# Altium schematic sheet 09.Ethernet-RGMII.SchDoc
size A3; CheckDate: CheckedDate; CheckedBy: YPC; DocumentNumber: 9; Revision: V1.00; SheetNumber: 09; SheetTotal: 18; SheetName: Ethernet-RGMII; SheetDescribe: 千兆以太网; Designer: JOW; DesignDate: 2025-04-25; CheckedData: 2025-04-25; Rule: PcbType=ProtelPcb
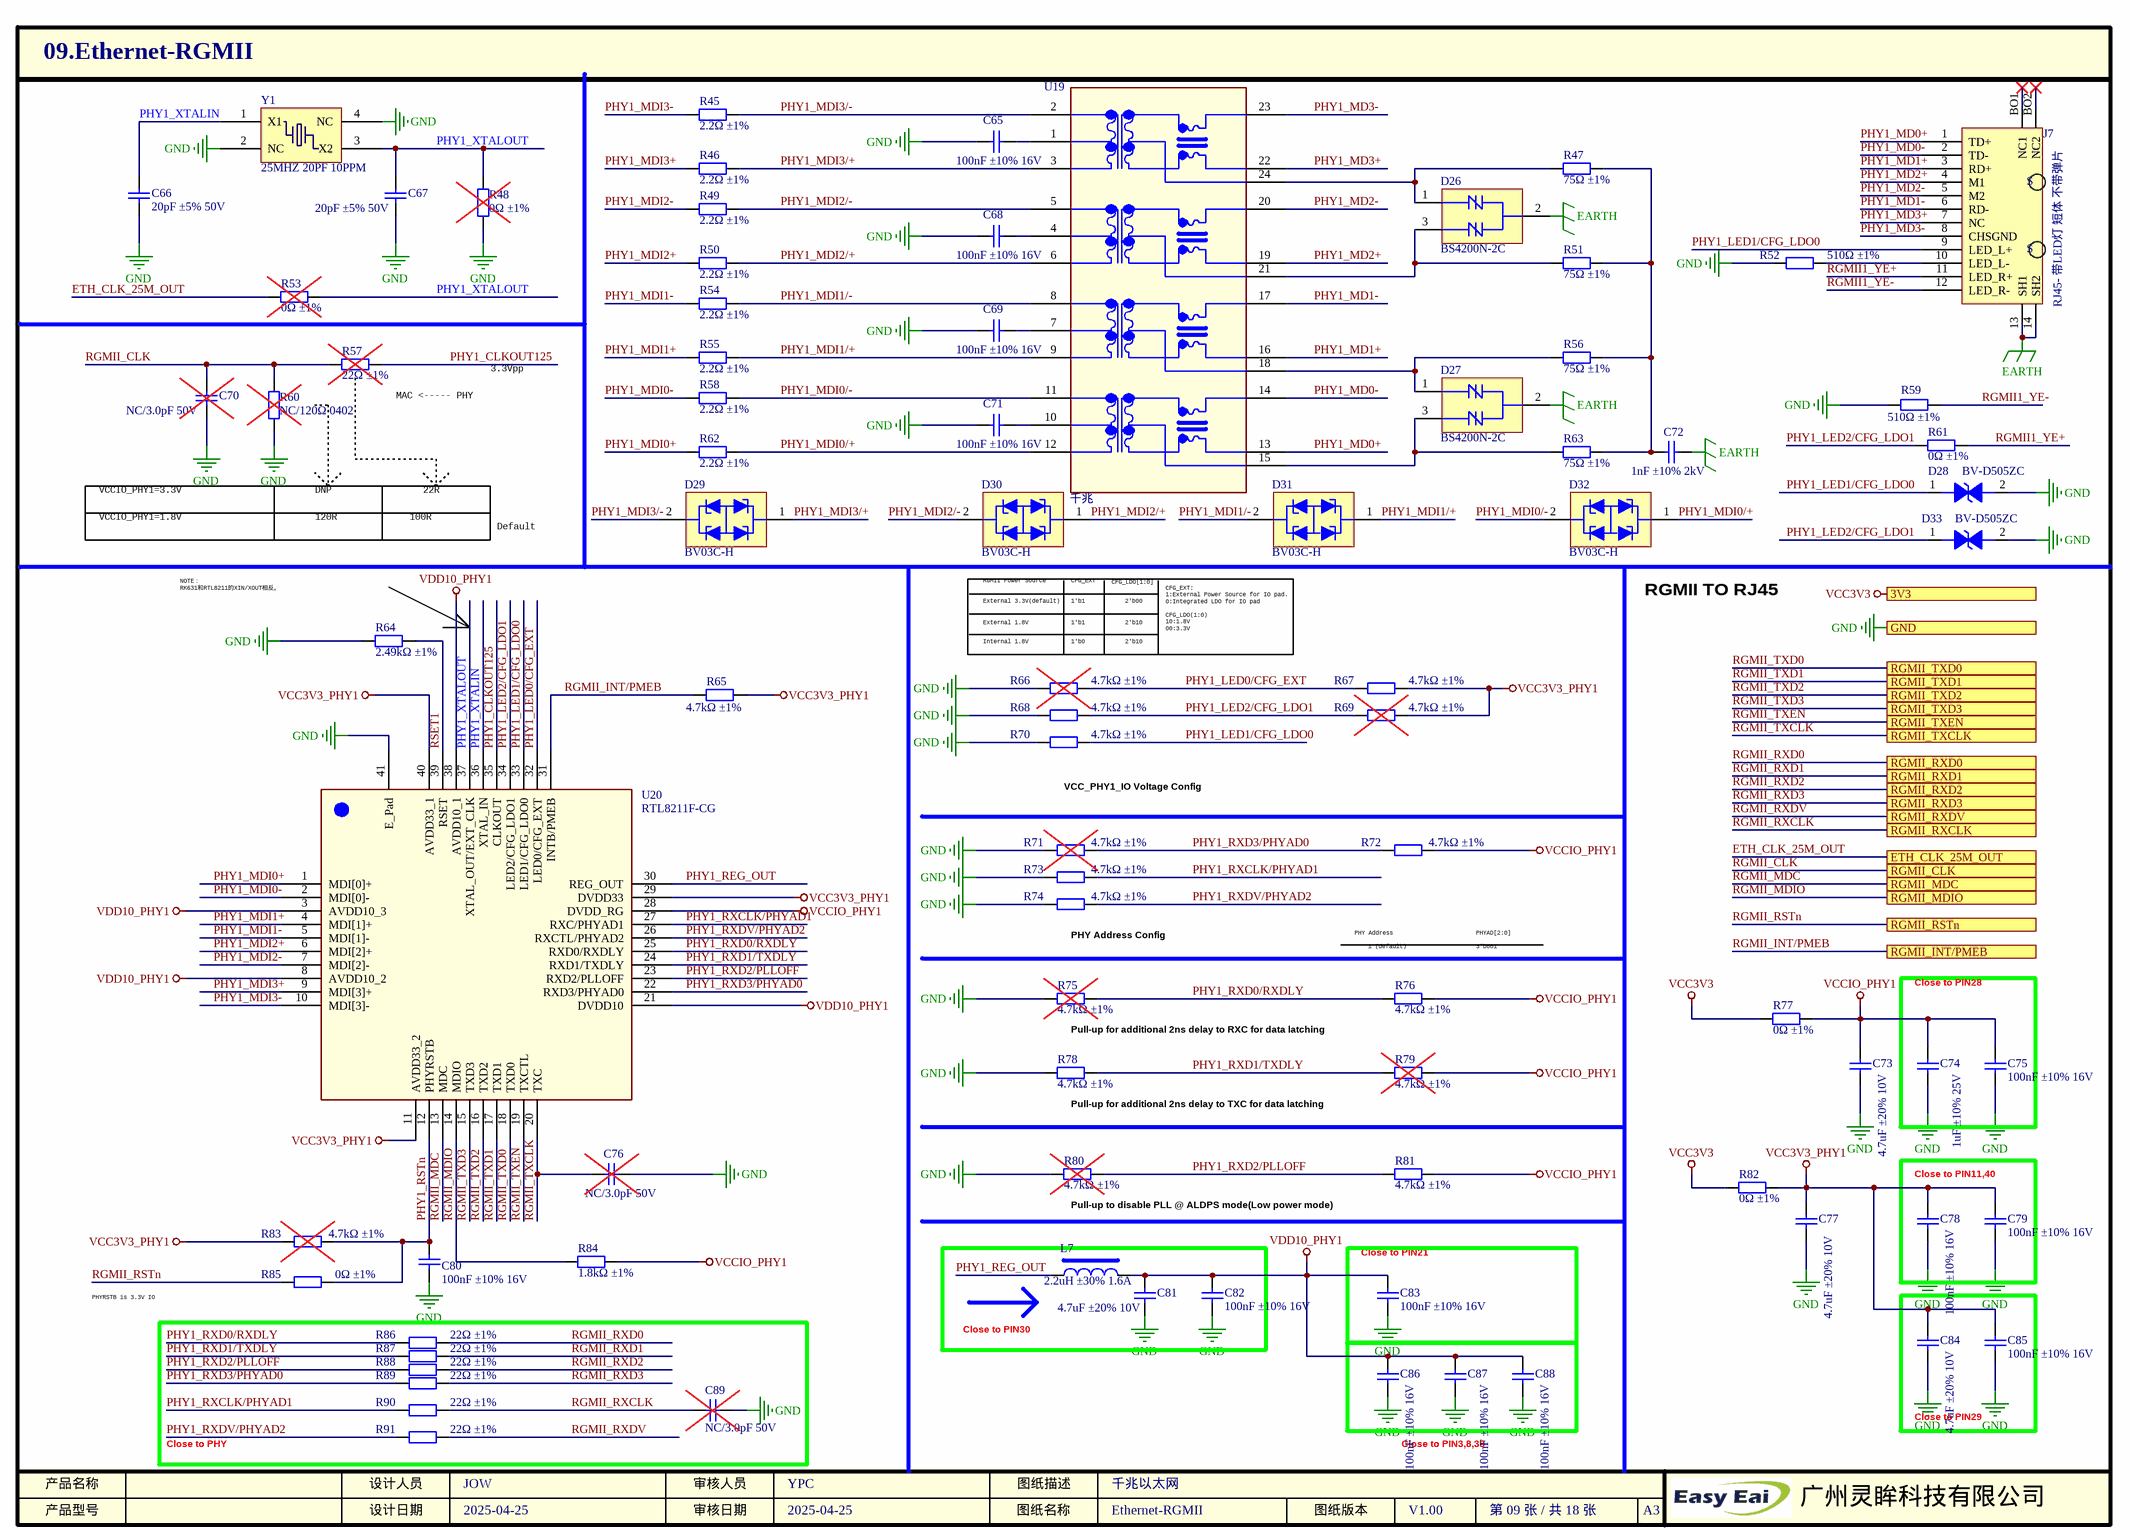
[diagram p0: 09.Ethernet-RGMII.SchDoc]

## Parts
C65  描述: 100nF ±10% 16V  [0402_C]  (hidden comment: CL05B104KO5NNNC)
C66  描述: 20pF ±5% 50V  [0402_C]  (hidden comment: 0402CG200J500NT)
C67  描述: 20pF ±5% 50V  [0402_C]  (hidden comment: 0402CG200J500NT)
C68  描述: 100nF ±10% 16V  [0402_C]  (hidden comment: CL05B104KO5NNNC)
C69  描述: 100nF ±10% 16V  [0402_C]  (hidden comment: CL05B104KO5NNNC)
C70  NC/3.0pF 50V  [0402_C]  (no BOM)
C71  描述: 100nF ±10% 16V  [0402_C]  (hidden comment: CL05B104KO5NNNC)
C72  描述: 1nF ±10% 2kV  [1206_C]  (hidden comment: CC1206KKX7RDBB102)
C73  描述: 4.7uF ±20% 10V  [0402_C]  (hidden comment: CL05A475MP5NRNC)
C74  描述: 1uF ±10% 25V  [0402_C]  (hidden comment: CL05A105KA5NQNC)
C75  描述: 100nF ±10% 16V  [0402_C]  (hidden comment: CL05B104KO5NNNC)
C76  NC/3.0pF 50V  [0402_C]  (no BOM)
C77  描述: 4.7uF ±20% 10V  [0402_C]  (hidden comment: CL05A475MP5NRNC)
C78  描述: 100nF ±10% 16V  [0402_C]  (hidden comment: CL05B104KO5NNNC)
C79  描述: 100nF ±10% 16V  [0402_C]  (hidden comment: CL05B104KO5NNNC)
C80  描述: 100nF ±10% 16V  [0402_C]  (hidden comment: CL05B104KO5NNNC)
C81  描述: 4.7uF ±20% 10V  [0402_C]  (hidden comment: CL05A475MP5NRNC)
C82  描述: 100nF ±10% 16V  [0402_C]  (hidden comment: CL05B104KO5NNNC)
C83  描述: 100nF ±10% 16V  [0402_C]  (hidden comment: CL05B104KO5NNNC)
C84  描述: 4.7uF ±20% 10V  [0402_C]  (hidden comment: CL05A475MP5NRNC)
C85  描述: 100nF ±10% 16V  [0402_C]  (hidden comment: CL05B104KO5NNNC)
C86  描述: 100nF ±10% 16V  [0402_C]  (hidden comment: CL05B104KO5NNNC)
C87  描述: 100nF ±10% 16V  [0402_C]  (hidden comment: CL05B104KO5NNNC)
C88  描述: 100nF ±10% 16V  [0402_C]  (hidden comment: CL05B104KO5NNNC)
C89  NC/3.0pF 50V  [0402_C]  (no BOM)
D26  BS4200N-2C  [SMB-T_L5.4-W3.3-BI]
D27  BS4200N-2C  [SMB-T_L5.4-W3.3-BI]
D28  BV-D505ZC  [SOD-523]
D29  BV03C-H  [SOD-323]
D30  BV03C-H  [SOD-323]
D31  BV03C-H  [SOD-323]
D32  BV03C-H  [SOD-323]
D33  BV-D505ZC  [SOD-523]
J7  R-RJ45R08P-C000  [RJ45/LED-1575X1626X1310]  (value not drawn)
L7  SWPA3015S2R2NT  [IND-SMD_L3.0-W3.0]  (value not drawn)
R45  描述: 2.2Ω ±1%  [0402_R]  (hidden comment: 0402WGF220KTCE)
R46  描述: 2.2Ω ±1%  [0402_R]  (hidden comment: 0402WGF220KTCE)
R47  描述: 75Ω ±1%  [0805_R]  (hidden comment: RS-05K75R0FT)
R48  描述: 0Ω ±1%  [0402_R]  (hidden comment: NC/0402WGF0000TCE)  (no BOM)
R49  描述: 2.2Ω ±1%  [0402_R]  (hidden comment: 0402WGF220KTCE)
R50  描述: 2.2Ω ±1%  [0402_R]  (hidden comment: 0402WGF220KTCE)
R51  描述: 75Ω ±1%  [0805_R]  (hidden comment: RS-05K75R0FT)
R52  描述: 510Ω ±1%  [0402_R]  (hidden comment: 0402WGF5100TCE)
R53  描述: 0Ω ±1%  [0402_R]  (hidden comment: NC/0402WGF0000TCE)  (no BOM)
R54  描述: 2.2Ω ±1%  [0402_R]  (hidden comment: 0402WGF220KTCE)
R55  描述: 2.2Ω ±1%  [0402_R]  (hidden comment: 0402WGF220KTCE)
R56  描述: 75Ω ±1%  [0805_R]  (hidden comment: RS-05K75R0FT)
R57  描述: 22Ω ±1%  [0402_R]  (hidden comment: 0402WGF220JTCE)  (no BOM)
R58  描述: 2.2Ω ±1%  [0402_R]  (hidden comment: 0402WGF220KTCE)
R59  描述: 510Ω ±1%  [0402_R]  (hidden comment: 0402WGF5100TCE)
R60  NC/120Ω 0402  [0402_R]  (no BOM)
R61  描述: 0Ω ±1%  [0402_R]  (hidden comment: 0402WGF0000TCE)
R62  描述: 2.2Ω ±1%  [0402_R]  (hidden comment: 0402WGF220KTCE)
R63  描述: 75Ω ±1%  [0805_R]  (hidden comment: RS-05K75R0FT)
R64  描述: 2.49kΩ ±1%  [0402_R]  (hidden comment: AC0402FR-072K49L)
R65  描述: 4.7kΩ ±1%  [0402_R]  (hidden comment: 0402WGF4701TCE)
R66  描述: 4.7kΩ ±1%  [0402_R]  (hidden comment: NC/0402WGF4701TCE)  (no BOM)
R67  描述: 4.7kΩ ±1%  [0402_R]  (hidden comment: 0402WGF4701TCE)
R68  描述: 4.7kΩ ±1%  [0402_R]  (hidden comment: 0402WGF4701TCE)
R69  描述: 4.7kΩ ±1%  [0402_R]  (hidden comment: NC/0402WGF4701TCE)  (no BOM)
R70  描述: 4.7kΩ ±1%  [0402_R]  (hidden comment: 0402WGF4701TCE)
R71  描述: 4.7kΩ ±1%  [0402_R]  (hidden comment: NC/0402WGF4701TCE)  (no BOM)
R72  描述: 4.7kΩ ±1%  [0402_R]  (hidden comment: 0402WGF4701TCE)
R73  描述: 4.7kΩ ±1%  [0402_R]  (hidden comment: 0402WGF4701TCE)
R74  描述: 4.7kΩ ±1%  [0402_R]  (hidden comment: 0402WGF4701TCE)
R75  描述: 4.7kΩ ±1%  [0402_R]  (hidden comment: NC/0402WGF4701TCE)  (no BOM)
R76  描述: 4.7kΩ ±1%  [0402_R]  (hidden comment: 0402WGF4701TCE)
R77  描述: 0Ω ±1%  [0402_R]  (hidden comment: 0402WGF0000TCE)
R78  描述: 4.7kΩ ±1%  [0402_R]  (hidden comment: 0402WGF4701TCE)
R79  描述: 4.7kΩ ±1%  [0402_R]  (hidden comment: NC/0402WGF4701TCE)  (no BOM)
R80  描述: 4.7kΩ ±1%  [0402_R]  (hidden comment: NC/0402WGF4701TCE)  (no BOM)
R81  描述: 4.7kΩ ±1%  [0402_R]  (hidden comment: 0402WGF4701TCE)
R82  描述: 0Ω ±1%  [0402_R]  (hidden comment: 0402WGF0000TCE)
R83  描述: 4.7kΩ ±1%  [0402_R]  (hidden comment: NC/0402WGF4701TCE)  (no BOM)
R84  描述: 1.8kΩ ±1%  [0402_R]  (hidden comment: 0402WGF1801TCE)
R85  描述: 0Ω ±1%  [0402_R]  (hidden comment: 0402WGF0000TCE)
R86  描述: 22Ω ±1%  [0402_R]  (hidden comment: 0402WGF220JTCE)
R87  描述: 22Ω ±1%  [0402_R]  (hidden comment: 0402WGF220JTCE)
R88  描述: 22Ω ±1%  [0402_R]  (hidden comment: 0402WGF220JTCE)
R89  描述: 22Ω ±1%  [0402_R]  (hidden comment: 0402WGF220JTCE)
R90  描述: 22Ω ±1%  [0402_R]  (hidden comment: 0402WGF220JTCE)
R91  描述: 22Ω ±1%  [0402_R]  (hidden comment: 0402WGF220JTCE)
U19  描述: 千兆  [SMD-24_L15.1-W7.1-P1.00-LS10.0-BL]  (hidden comment: G2401CE)
U20  RTL8211F-CG  [QFN40P500X500X90_HS-41N]
Y1  X322525MSB4SI  [SMD-3225_4P]  (value not drawn)

## Blocks framed on the sheet
Close to PIN28: C74 C75
Close to PIN11,40: C78 C79
Close to PIN30: C81 C82 L7
Close to PIN21: C83
Close to PHY: C89 R86-R91
Close to PIN29: C84 C85

## Ports
3V3, ETH_CLK_25M_OUT, GND, RGMII_CLK, RGMII_INT/PMEB, RGMII_MDC, RGMII_MDIO, RGMII_RSTn, RGMII_RXCLK, RGMII_RXD0, RGMII_RXD1, RGMII_RXD2, RGMII_RXD3, RGMII_RXDV, RGMII_TXCLK, RGMII_TXD0, RGMII_TXD1, RGMII_TXD2, RGMII_TXD3, RGMII_TXEN

## Nets
EARTH: C72.2 D26.2 D27.2 J7.13(SH1) J7.14(SH2)
GND: C65.1 C66.1 C67.1 C68.1 C69.1 C70.1 C71.1 C73.1 C74.1 C75.1 C76.2 C77.1 C78.1 C79.1 C80.1 C81.1 C82.1 C83.1 C84.1 C85.1 C86.1 C87.1 C88.1 C89.1 D28.2 D33.2 R48.1 R52.1 R59.1 R60.1 R64.1 R66.1 R68.1 R70.1 R71.1 R73.1 R74.1 R75.1 R78.1 R80.1 U20.41(E_Pad) Y1.2(NC) Y1.4(NC) ; port GND
VCC3V3: R77.1 R82.1 ; port 3V3
VCC3V3_PHY1: C77.2 C78.2 C79.2 C84.2 C85.2 R65.2 R67.2 R69.2 R82.2 R83.1 U20.11(AVDD33_2) U20.29(DVDD33) U20.40(AVDD33_1)
VCCIO_PHY1: C73.2 C74.2 C75.2 R72.2 R76.2 R77.2 R79.2 R81.2 R84.2 U20.28(DVDD_RG)
VDD10_PHY1: C81.2 C82.2 C83.2 C86.2 C87.2 C88.2 L7.2 U20.3(AVDD10_3) U20.8(AVDD10_2) U20.21(DVDD10) U20.38(AVDD10_1)
ETH_CLK_25M_OUT: R53.2 ; port ETH_CLK_25M_OUT
PHY1_CLKOUT125: R57.2 U20.35(CLKOUT)
PHY1_LED0/CFG_EXT: R66.2 R67.1 U20.32(LED0/CFG_EXT)
PHY1_LED1/CFG_LDO0: D28.1 J7.9(LED_L+) R70.2 U20.33(LED1/CFG_LDO0)
PHY1_LED2/CFG_LDO1: D33.1 R61.1 R68.2 R69.1 U20.34(LED2/CFG_LDO1)
PHY1_MD0+: J7.1(TD+) U19.13
PHY1_MD0-: J7.2(TD-) U19.14
PHY1_MD1+: J7.3(RD+) U19.16
PHY1_MD1-: J7.6(RD-) U19.17
PHY1_MD2+: J7.4(M1) U19.19
PHY1_MD2-: J7.5(M2) U19.20
PHY1_MD3+: J7.7(NC) U19.22
PHY1_MD3-: J7.8(CHSGND) U19.23
PHY1_MDI0+: R62.1 U20.1(MDI[0]+)
PHY1_MDI0-: R58.1 U20.2(MDI[0]-)
PHY1_MDI0/+: D32.1 R62.2 U19.12
PHY1_MDI0/-: D32.2 R58.2 U19.11
PHY1_MDI1+: R55.1 U20.4(MDI[1]+)
PHY1_MDI1-: R54.1 U20.5(MDI[1]-)
PHY1_MDI1/+: D31.1 R55.2 U19.9
PHY1_MDI1/-: D31.2 R54.2 U19.8
PHY1_MDI2+: R50.1 U20.6(MDI[2]+)
PHY1_MDI2-: R49.1 U20.7(MDI[2]-)
PHY1_MDI2/+: D30.1 R50.2 U19.6
PHY1_MDI2/-: D30.2 R49.2 U19.5
PHY1_MDI3+: R46.1 U20.9(MDI[3]+)
PHY1_MDI3-: R45.1 U20.10(MDI[3]-)
PHY1_MDI3/+: D29.1 R46.2 U19.3
PHY1_MDI3/-: D29.2 R45.2 U19.2
PHY1_REG_OUT: L7.1 U20.30(REG_OUT)
PHY1_RSTn: C80.2 R83.2 R85.2 U20.12(PHYRSTB)
PHY1_RXCLK/PHYAD1: R73.2 R90.1 U20.27(RXC/PHYAD1)
PHY1_RXD0/RXDLY: R75.2 R76.1 R86.1 U20.25(RXD0/RXDLY)
PHY1_RXD1/TXDLY: R78.2 R79.1 R87.1 U20.24(RXD1/TXDLY)
PHY1_RXD2/PLLOFF: R80.2 R81.1 R88.1 U20.23(RXD2/PLLOFF)
PHY1_RXD3/PHYAD0: R71.2 R72.1 R89.1 U20.22(RXD3/PHYAD0)
PHY1_RXDV/PHYAD2: R74.2 R91.1 U20.26(RXCTL/PHYAD2)
PHY1_XTALIN: C66.2 U20.36(XTAL_IN) Y1.1(X1)
PHY1_XTALOUT: C67.2 R48.2 R53.1 U20.37(XTAL_OUT/EXT_CLK) Y1.3(X2)
RGMII1_YE+: J7.11(LED_R+) R61.2
RGMII1_YE-: J7.12(LED_R-) R59.2
RGMII_CLK: C70.2 R57.1 R60.2 ; port RGMII_CLK
RGMII_INT/PMEB: R65.1 U20.31(INTB/PMEB) ; port RGMII_INT/PMEB
RGMII_MDC: U20.13(MDC) ; port RGMII_MDC
RGMII_MDIO: R84.1 U20.14(MDIO) ; port RGMII_MDIO
RGMII_RSTn: R85.1 ; port RGMII_RSTn
RGMII_RXCLK: C89.2 R90.2 ; port RGMII_RXCLK
RGMII_RXD0: R86.2 ; port RGMII_RXD0
RGMII_RXD1: R87.2 ; port RGMII_RXD1
RGMII_RXD2: R88.2 ; port RGMII_RXD2
RGMII_RXD3: R89.2 ; port RGMII_RXD3
RGMII_RXDV: R91.2 ; port RGMII_RXDV
RGMII_TXCLK: C76.1 U20.20(TXC) ; port RGMII_TXCLK
RGMII_TXD0: U20.18(TXD0) ; port RGMII_TXD0
RGMII_TXD1: U20.17(TXD1) ; port RGMII_TXD1
RGMII_TXD2: U20.16(TXD2) ; port RGMII_TXD2
RGMII_TXD3: U20.15(TXD3) ; port RGMII_TXD3
RGMII_TXEN: U20.19(TXCTL) ; port RGMII_TXEN
RSET1: R64.2 U20.39(RSET)
NetC65_2: C65.2 U19.1
NetC68_2: C68.2 U19.4
NetC69_2: C69.2 U19.7
NetC71_2: C71.2 U19.10
NetC72_1: C72.1 R47.2 R51.2 R56.2 R63.2
NetD26_1: D26.1 R47.1 U19.24
NetD26_3: D26.3 R51.1 U19.21
NetD27_1: D27.1 R56.1 U19.18
NetD27_3: D27.3 R63.1 U19.15
NetJ7_10: J7.10(LED_L-) R52.2

Not connected (* = marked no-connect by the designer): J7 BO1(NC1)* BO2(NC2)*

## Notes on the sheet
- (near R57) MAC <----- PHY
- 3.3Vpp
- VCCIO_PHY1=3.3V
- VCCIO_PHY1=1.8V
- DNP
- 120R
- 100R
- 22R
- Default
- (near R64) NOTE：
  RK631和RTL8211的XIN/XOUT相反。
- RGMII Power Source
- External 3.3V(default)
- CFG_EXT
- 1'b1
- CFG_LDO[1:0]
- 2'b00
- RGMII TO RJ45
- External 1.8V
- Internal 1.8V
- (near R66) 1'b0
- 2'b10
- CFG_EXT:
  1:External Power Source for IO pad.
  0:Integrated LDO for IO pad
  CFG_LDO(1:0)
  10:1.8V
  00:3.3V
- VCC_PHY1_IO Voltage Config
- (near R74) PHY Address Config
- PHY Address
- PHYAD[2:0]
- (near R76) 1 (default)
- 3'b001
- Pull-up for additional 2ns delay to RXC for data latching
- (near R78) Pull-up for additional 2ns delay to TXC for data latching
- (near R80) Pull-up to disable PLL @ ALDPS mode(Low power mode)
- PHYRSTB is 3.3V IO
- Close to PIN3,8,38
- 产品名称
- 产品型号
- 设计人员
- 设计日期
- 审核人员
- 审核日期
- 图纸名称
- 图纸描述
- 图纸版本
- A3
- 广州灵眸科技有限公司
- (in symbol RJ45- 带LED灯 短体 不带弹片) S

## Library data of the parts
C65 C68 C69 C71 C75 C78-C80 C82 C83 C85-C88 = 0402 100nF ±10% 16V: SPZL000259; 名称: 贴片电容; 厂商: SAMSUNG(三星); 封装: 0402; 工作温度: -55~125℃; 贴片和直插: SMD; 型号: CL05B104KO5NNNC; SuppliersPartNumber: C1525; 商品编号: SPZL000259
C66 C67 = 0402 20pF ±5% 50V: SPZL000398; 名称: 贴片电容; 厂商: FH(风华); 封装: 0402; 工作温度: -55~125℃; 贴片和直插: SMD; 型号: 0402CG200J500NT; SuppliersPartNumber: C1554; 商品编号: SPZL000398
C70 C76 C89 = 0402 2.0pF (2R0) 0.25pF 50V: 贴片电容; ComponentLink1Description: 供应商链接; ComponentLink1URL: http://www.szlcsc.com/product/details_1910.html; Package: 0402; Supplier: LC
C72 = 1206 1nF ±10% 2kV: SPZL000332; 名称: 贴片电容; 厂商: YAGEO(国巨); 封装: 1206; 工作温度: -55~125℃; 贴片和直插: SMD; 型号: CC1206KKX7RDBB102; SuppliersPartNumber: C23631; 商品编号: SPZL000332
C73 C77 C81 C84 = 0402 4.7uF ±20% 10V: SPZL000339; 名称: 贴片电容; 厂商: SAMSUNG(三星); 封装: 0402; 工作温度: -55~85℃; 贴片和直插: SMD; 型号: CL05A475MP5NRNC; SuppliersPartNumber: C23733; 商品编号: SPZL000339
C74 = 0402 1uF ±10% 25V: SPZL000337; 名称: 贴片电容; 厂商: SAMSUNG(三星); 封装: 0402; 工作温度: -55~85℃; 贴片和直插: SMD; 型号: CL05A105KA5NQNC; SuppliersPartNumber: C52923; 商品编号: SPZL000337
D26 D27 = 放电管 BS4200N-2C: SPZL000612; 名称: 放电管; 封装: SMB-T; 贴片和直插: SMD; 厂商: Bencent(槟城); 工作温度: -40~125℃; 商品编号: SPZL000612; 型号: BS4200N-2C
D28 D33 = ESD BV-D505ZC: SPZL000613; 名称: ESD; 贴片和直插: SMD; 厂商: Bencent(槟城); 描述: Vdrm=5V Cj=15pF; 工作温度: -40~125℃; SuppliersPartNumber: C459520; 封装: SOD-523; 商品编号: SPZL000613; 型号: BV-D505ZC
D29-D32 = ESD BV03C-H: SPZL000614; 名称: ESD; 贴片和直插: SMD; 厂商: Bencent(槟城); 描述: Vdrm=3.3V Cj=1.5pF; 工作温度: -55~150℃; 封装: SOD-323; SuppliersPartNumber: C883203; 商品编号: SPZL000614; 型号: BV03C-H
J7 = RJ45- 带LED灯 短体 不带弹片: SPZL000140; 名称: RJ45插座; 贴片和直插: THT; 封装: Through Hole; 厂商: Ckmtw(灿科盟); 工作温度: 0~70℃; SuppliersPartNumber: C386757; 型号: R-RJ45R08P-C000; 商品编号: SPZL000140; 描述: RJ45- 带LED灯 短体 不带弹片
L7 = 2.2uH ±30% 1.6A: SPZL000721; 名称: 电感; 厂商: Sunlord(顺络); 封装: SMD; 工作温度: -40~125℃; 型号: SWPA3015S2R2NT; SuppliersPartNumber: C19734; 贴片和直插: SMD; 商品编号: SPZL000721; 描述: 2.2uH ±30% 1.6A
R45 R46 R49 R50 R54 R55 R58 R62 = 0402 2.2Ω ±1%: SPZL000327; 封装: 0402; 厂商: UNI-ROYAL(厚声); 贴片和直插: SMD; 名称: 电阻; 工作温度: -55~155℃; SuppliersPartNumber: C25101; 型号: 0402WGF220KTCE; 商品编号: SPZL000327
R47 R51 R56 R63 = 0805 75Ω ±1%: SPZL000353; 封装: 0805; 厂商: FH(风华); 名称: 电阻; 贴片和直插: SMD; 工作温度: -55~155℃; SuppliersPartNumber: C139842; 型号: RS-05K75R0FT; 商品编号: SPZL000353
R48 R53 R61 R77 R82 R85 = 0402 0Ω ±1%: SPZL000276; 封装: 0402; 厂商: UNI-ROYAL(厚声); 贴片和直插: SMD; 名称: 电阻; 工作温度: -55~125℃; SuppliersPartNumber: C17168; 型号: 0402WGF0000TCE; 商品编号: SPZL000276
R52 R59 = 0402 510Ω ±1%: SPZL000335; 封装: 0402; 厂商: UNI-ROYAL(厚声); 贴片和直插: SMD; 名称: 电阻; 工作温度: -55~155℃; SuppliersPartNumber: C25123; 型号: 0402WGF5100TCE; 商品编号: SPZL000335
R57 R86-R91 = 0402 22Ω ±1%: SPZL000279; 封装: 0402; 厂商: UNI-ROYAL(厚声); 贴片和直插: SMD; 名称: 电阻; 工作温度: -55~155℃; SuppliersPartNumber: C25092; 型号: 0402WGF220JTCE; 商品编号: SPZL000279
R60 = 0402 120Ω (1200) 1%: 贴片电阻; ComponentLink1Description: 供应商链接; ComponentLink1URL: http://www.szlcsc.com/product/details_25822.html; Package: 0402; Supplier: LC; SuppliersPartNumber: C25079
R64 = 0402 2.49kΩ ±1%: SPZL000354; 封装: 0402; 厂商: YAGEO(国巨); 贴片和直插: SMD; 名称: 电阻; 工作温度: -55~155℃; SuppliersPartNumber: C226959; 型号: AC0402FR-072K49L; 商品编号: SPZL000354
R65-R76 R78-R81 R83 = 0402 4.7kΩ ±1%: SPZL000280; 封装: 0402; 厂商: UNI-ROYAL(厚声); 贴片和直插: SMD; 名称: 电阻; 工作温度: -55~155℃; SuppliersPartNumber: C25900; 型号: 0402WGF4701TCE; 商品编号: SPZL000280
R84 = 0402 1.8kΩ ±1%: SPZL000899; 封装: 0402; 厂商: UNI-ROYAL(厚声); 贴片和直插: SMD; 名称: 电阻; 工作温度: -55~155℃; SuppliersPartNumber: C25871; 型号: 0402WGF1801TCE; 商品编号: SPZL000899
U19 = 网络变压器 G2401CE: SPZL000720; 封装: SMD; 名称: 网络变压器; 厂商: Mentech(铭普光磁); 工作温度: -40~+85℃; 型号: G2401CE; 贴片和直插: SMD; SuppliersPartNumber: C2904710; 商品编号: SPZL000720
U20 = RTL8211F-CG: SPZL000719; 名称: IC; 封装: WQFN-40-EP(5x5); 厂商: REALTEK(瑞昱); 贴片和直插: SMD; 工作温度: 0~70℃; 描述: RTL8211F-CG; 商品编号: SPZL000719; SuppliersPartNumber: C187932; 型号: RTL8211F-CG
Y1 = 25MHZ 20PF 10PPM: SPZL000475; 封装: SMD3225-4P; 厂商: YXC扬兴科技; 贴片和直插: SMD; 名称: 无源晶振; 工作温度: -40~85℃; SuppliersPartNumber: C13740; 型号: X322525MSB4SI; 商品编号: SPZL000475; 描述: 25MHZ 20PF 10PPM